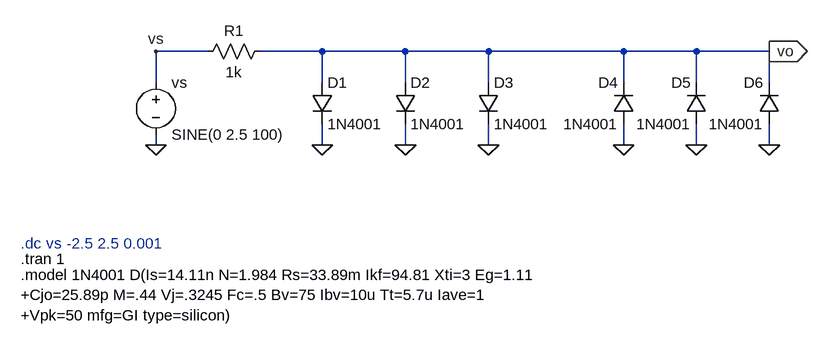
[diagram p0: schematic Lab6p3b.asc]
Lab6p3b.asc, the LTspice schematic file:
Version 4
SHEET 1 1400 680
WIRE 288 16 208 16
WIRE 464 16 368 16
WIRE 592 16 464 16
WIRE 720 16 592 16
WIRE 928 16 720 16
WIRE 1040 16 928 16
WIRE 1152 16 1040 16
WIRE 208 64 208 16
WIRE 464 64 464 16
WIRE 592 64 592 16
WIRE 720 64 720 16
WIRE 928 64 928 16
WIRE 1040 64 1040 16
WIRE 1152 64 1152 16
WIRE 208 160 208 144
WIRE 464 160 464 128
WIRE 592 160 592 128
WIRE 720 160 720 128
WIRE 928 160 928 128
WIRE 1040 160 1040 128
WIRE 1152 160 1152 128
FLAG 464 160 0
FLAG 208 160 0
FLAG 1152 16 vo
IOPIN 1152 16 Out
FLAG 208 16 vs
FLAG 928 160 0
FLAG 592 160 0
FLAG 720 160 0
FLAG 1040 160 0
FLAG 1152 160 0
SYMBOL diode 448 64 R0
SYMATTR InstName D1
SYMATTR Value 1N4001
SYMBOL voltage 208 48 R0
WINDOW 123 0 0 Left 0
WINDOW 39 0 0 Left 0
SYMATTR InstName vs
SYMATTR Value SINE(0 2.5 100)
SYMBOL res 384 0 R90
WINDOW 0 0 56 VBottom 2
WINDOW 3 32 56 VTop 2
SYMATTR InstName R1
SYMATTR Value 1k
SYMBOL diode 944 128 R180
WINDOW 0 24 64 Left 2
WINDOW 3 24 0 Left 2
SYMATTR InstName D4
SYMATTR Value 1N4001
SYMBOL diode 576 64 R0
SYMATTR InstName D2
SYMATTR Value 1N4001
SYMBOL diode 704 64 R0
SYMATTR InstName D3
SYMATTR Value 1N4001
SYMBOL diode 1056 128 R180
WINDOW 0 24 64 Left 2
WINDOW 3 24 0 Left 2
SYMATTR InstName D5
SYMATTR Value 1N4001
SYMBOL diode 1168 128 R180
WINDOW 0 24 64 Left 2
WINDOW 3 24 0 Left 2
SYMATTR InstName D6
SYMATTR Value 1N4001
TEXT 0 360 Left 2 !.model 1N4001 D(Is=14.11n N=1.984 Rs=33.89m Ikf=94.81 Xti=3 Eg=1.11\n+Cjo=25.89p M=.44 Vj=.3245 Fc=.5 Bv=75 Ibv=10u Tt=5.7u Iave=1\n+Vpk=50 mfg=GI type=silicon)
TEXT 0 336 Left 2 !.tran 1
TEXT 0 312 Left 2 ;.dc vs -2.5 2.5 0.001

The netlist it stands for:
* Lab6p3b.asc
D1 vo 0 1N4001
vs vs 0 SINE(0 2.5 100)
R1 vo vs 1k
D4 0 vo 1N4001
D2 vo 0 1N4001
D3 vo 0 1N4001
D5 0 vo 1N4001
D6 0 vo 1N4001
.model D D
.lib standard.dio
.model 1N4001 D(Is=14.11n N=1.984 Rs=33.89m Ikf=94.81 Xti=3 Eg=1.11
+Cjo=25.89p M=.44 Vj=.3245 Fc=.5 Bv=75 Ibv=10u Tt=5.7u Iave=1
+Vpk=50 mfg=GI type=silicon)
.tran 1
* .dc vs -2.5 2.5 0.001
.backanno
.end